# EAGLE schematic power supply diagram (EAGLE 9.6.2)
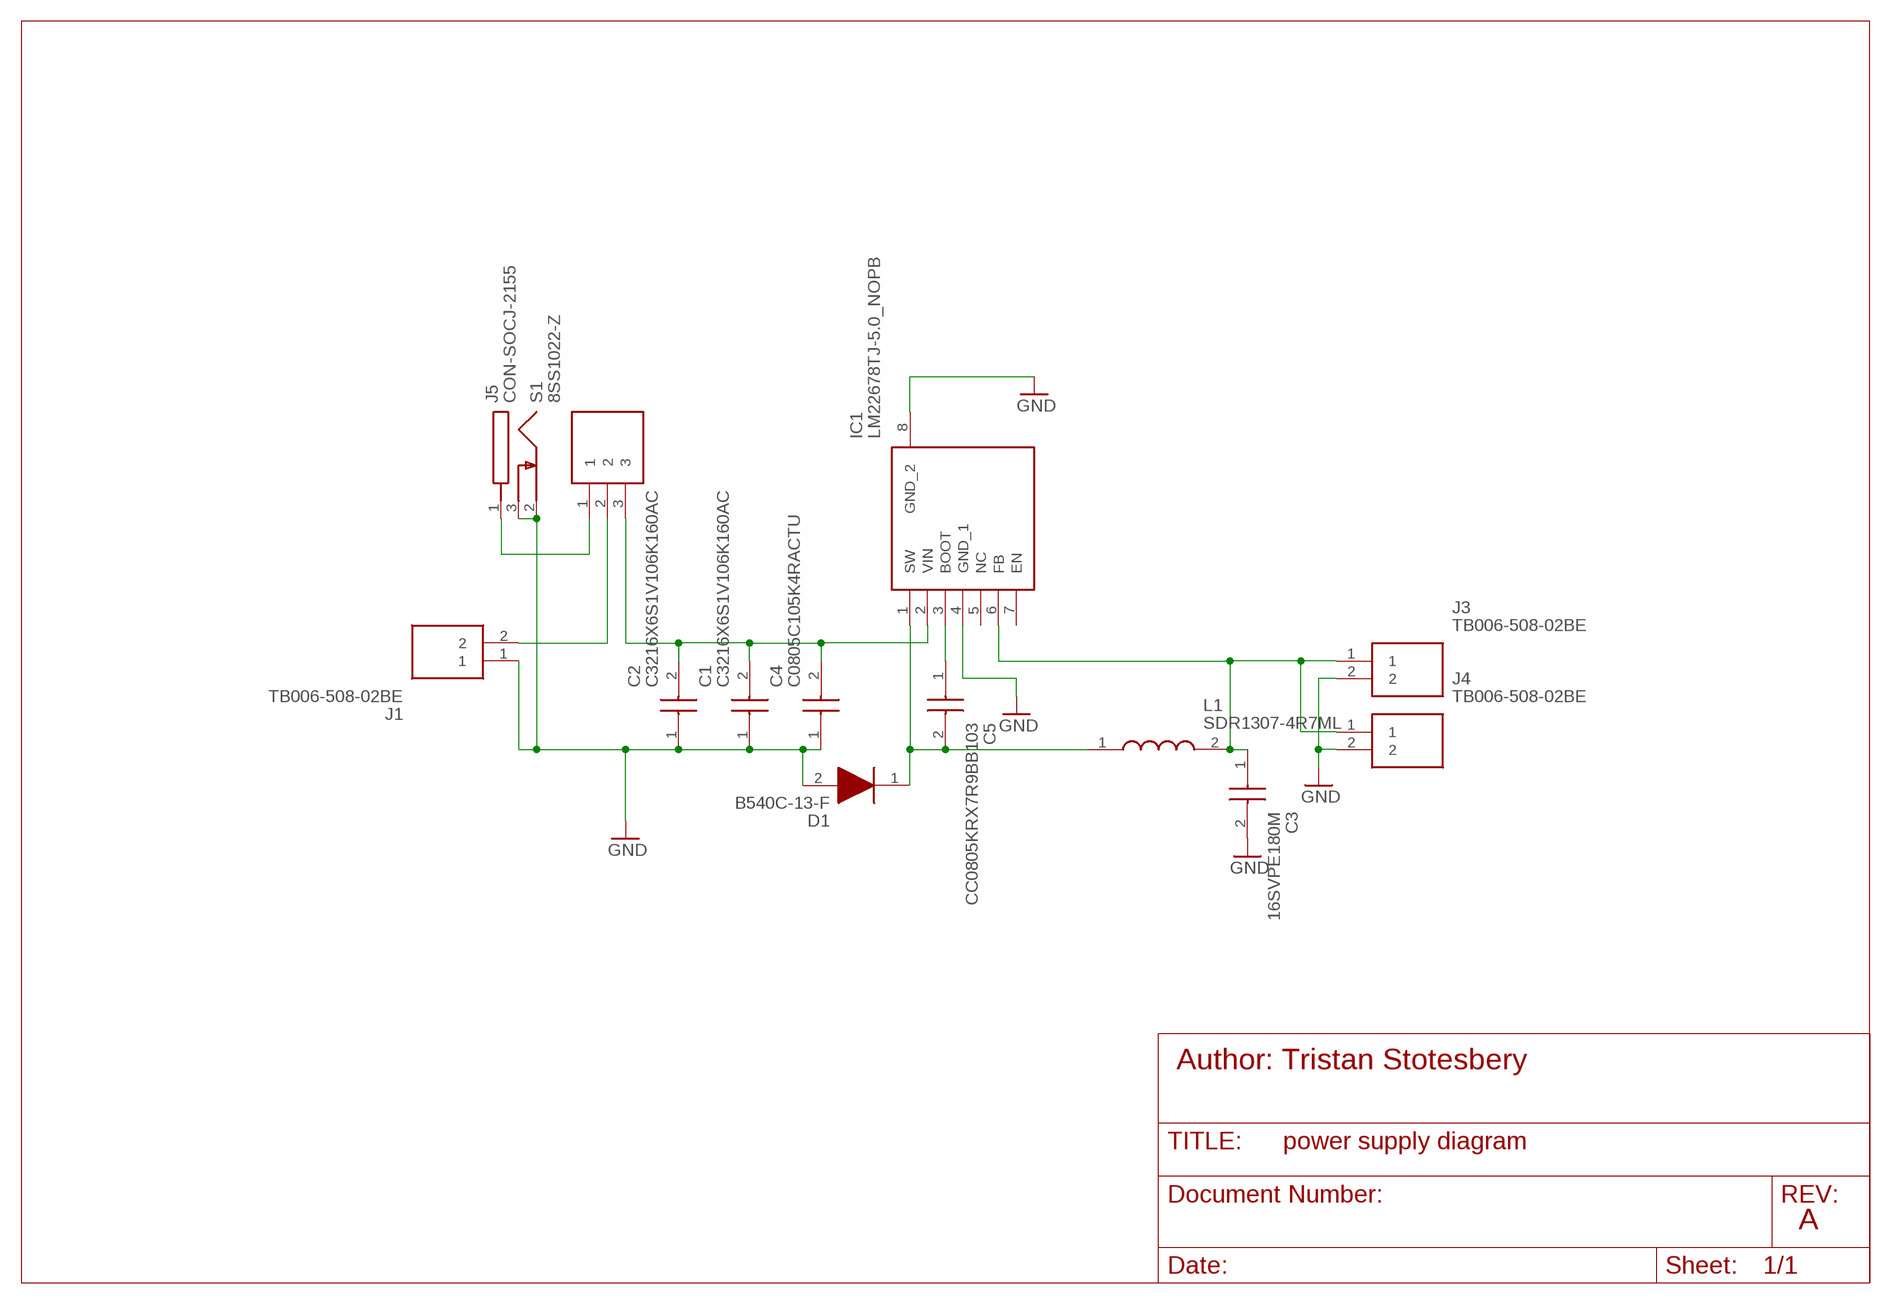
[diagram p0: schematic, sheet 1]

## Parts
C1  C3216X6S1V106K160AC  [CAPC3216X180N]
C2  C3216X6S1V106K160AC  [CAPC3216X180N]
C3  16SVPE180M  [16SVPE180M]
C4  C0805C105K4RACTU  [CAPC2012X100N]
C5  CC0805KRX7R9BB103  [CAPC2012X135N]
D1  B540C-13-F  [DIOM7959X250N]
IC1  LM22678TJ-5.0_NOPB  [LM22678TJ50NOPB]
J1  TB006-508-02BE  [TB00650802BE]
J3  TB006-508-02BE  [TB00650802BE]
J4  TB006-508-02BE  [TB00650802BE]
J5  CON-SOCJ-2155  [CONSOCJ2155]
L1  SDR1307-4R7ML  [SDR1307-220ML]
S1  8SS1022-Z  [8SS1022Z]

## Nets
GND: C1.1 C2.1 C3.2 C4.1 D1.2(A) IC1.4(GND_1) IC1.8(GND_2) J1.1 J3.2 J4.2 J5.2 J5.3
N$1: C1.2 C2.2 C4.2 IC1.2(VIN) S1.3
N$2: J1.2 S1.2
N$3: C5.1 IC1.3(BOOT)
N$4: C5.2 D1.1(K) IC1.1(SW) L1.1
N$5: C3.1 IC1.6(FB) J3.1 J4.1 L1.2
N$6: J5.1 S1.1
Unconnected: IC1.5(NC) IC1.7(EN)

## Notes on the sheet
- Author: Tristan Stotesbery
- A

## Library data of the parts
C1 C2 = SamacSys_Parts:C3216X6S1V106K160AC: Multilayer Ceramic Capacitors MLCC - SMD/SMT 1206 35V 10uF X6S 10% T: 1.6mm Source: Datasheet <https://product.tdk.com/info/en/catalog/datasheets/mlcc_commercial_midvoltage_en.pdf>; DESCRIPTION: Multilayer Ceramic Capacitors MLCC - SMD/SMT 1206 35V 10uF X6S 10% T: 1.6mm; HEIGHT: 1.8mm; MANUFACTURER_NAME: TDK; MANUFACTURER_PART_NUMBER: C3216X6S1V106K160AC; MOUSER_PART_NUMBER: 810-C3216X6S1V106K6A; MOUSER_PRICE-STOCK: https://www.mouser.co.uk/ProductDetail/TDK/C3216X6S1V106K160AC?qs=xLDY6iXSiQbqLIcRZVjJ3A%3D%3D
C3 = SamacSys_Parts:16SVPE180M: Panasonic Aluminium Polymer Capacitor 180uF 16V dc 6.3mm C10 OS-CON Series, Surface Mount Polymer, +/-20% 6.3 x 9.9mm Source: Datasheet <https://whttps://industrial.panasonic.com/cdbs/www-data/pdf/AAB8000/AAB8000C179.pdfww.arrow.com/en/products/16svpe180m/panasonic>; DESCRIPTION: Panasonic Aluminium Polymer Capacitor 180uF 16V dc 6.3mm C10 OS-CON Series, Surface Mount Polymer, +/-20% 6.3 x 9.9mm; HEIGHT: 10mm; MANUFACTURER_NAME: Panasonic; MANUFACTURER_PART_NUMBER: 16SVPE180M; MOUSER_PART_NUMBER: 667-16SVPE180M; MOUSER_PRICE-STOCK: https://www.mouser.co.uk/ProductDetail/Panasonic/16SVPE180M?qs=OE1iw1LrrPH8IiQtRMzKQA%3D%3D
C4 = SamacSys_Parts:C0805C105K4RACTU: 1uF Ceramic Multilayer Capacitor, 16V Source: Datasheet <http://www.kemet.com/Lists/ProductCatalog/Attachments/53/KEM_C1002_X7R_SMD.pdf>; DESCRIPTION: 1uF Ceramic Multilayer Capacitor, 16V; HEIGHT: 1mm; MANUFACTURER_NAME: Kemet; MANUFACTURER_PART_NUMBER: C0805C105K4RACTU; MOUSER_PART_NUMBER: 80-C0805C105K4R; MOUSER_PRICE-STOCK: https://www.mouser.co.uk/ProductDetail/KEMET/C0805C105K4RACTU?qs=yrVqjCObULOefkidH6lLLQ%3D%3D
C5 = SamacSys_Parts:CC0805KRX7R9BB103: 0805 X7R ceramic cap,10nF 50V Phycomp 10nF Multilayer Ceramic Capacitor (MLCC) 50 V dc +/-10% X7R dielectric Standard max op. temp. +125C Source: Datasheet; DESCRIPTION: 0805 X7R ceramic cap,10nF 50V Phycomp 10nF Multilayer Ceramic Capacitor (MLCC) 50 V dc +/-10% X7R dielectric Standard max op. temp. +125C; HEIGHT: 1.35mm; MANUFACTURER_NAME: YAGEO (PHYCOMP); MANUFACTURER_PART_NUMBER: CC0805KRX7R9BB103; MOUSER_PART_NUMBER: 603-CC805KRX7R9BB103; MOUSER_PRICE-STOCK: https://www.mouser.co.uk/ProductDetail/Yageo/CC0805KRX7R9BB103?qs=AgBp2OyFlx%252BOmOw2rEcWJw%3D%3D
D1 = SamacSys_Parts:B540C-13-F: Diodes Inc B540C-13-F, SMT Schottky Diode, 40V 5A, 2-Pin DO-214AB Source: Datasheet <https://componentsearchengine.com/Datasheets/2/B540C-13-F.pdf>; DESCRIPTION: Diodes Inc B540C-13-F, SMT Schottky Diode, 40V 5A, 2-Pin DO-214AB; HEIGHT: 2.5mm; MANUFACTURER_NAME: Diodes Inc.; MANUFACTURER_PART_NUMBER: B540C-13-F; MOUSER_PART_NUMBER: 621-B540C-F; MOUSER_PRICE-STOCK: https://www.mouser.co.uk/ProductDetail/Diodes-Incorporated/B540C-13-F?qs=v2dnQLbuoRZXHN%2FK4ft5%252Bg%3D%3D
IC1 = SamacSys_Parts:LM22678TJ-5.0_NOPB: SIMPLE SWITCHER 4.5V to 42V, 5A Step-Down Voltage Regulator with Precision Enable Source: Datasheet <http://www.ti.com/lit/gpn/LM22678>; DESCRIPTION: SIMPLE SWITCHER 4.5V to 42V, 5A Step-Down Voltage Regulator with Precision Enable; HEIGHT: 2.1mm; MANUFACTURER_NAME: Texas Instruments; MANUFACTURER_PART_NUMBER: LM22678TJ-5.0/NOPB; MOUSER_PART_NUMBER: 926-LM22678TJ50NOPB; MOUSER_PRICE-STOCK: https://www.mouser.co.uk/ProductDetail/Texas-Instruments/LM22678TJ-50-NOPB?qs=X1J7HmVL2ZHigSTWjAFUig%3D%3D
J1 J3 J4 = SamacSys_Parts:TB006-508-02BE: Fixed Terminal Blocks screw type, 5.08 , horizontal, 2 poles, CUI Blue, slotted screw, PCB mount Source: Datasheet; DESCRIPTION: Fixed Terminal Blocks screw type, 5.08 , horizontal, 2 poles, CUI Blue, slotted screw, PCB mount; HEIGHT: 10.4mm; MANUFACTURER_NAME: CUI Inc.; MANUFACTURER_PART_NUMBER: TB006-508-02BE; MOUSER_PART_NUMBER: 490-TB006-508-02BE; MOUSER_PRICE-STOCK: https://www.mouser.co.uk/ProductDetail/CUI-Devices/TB006-508-02BE?qs=vLWxofP3U2wEdOVV%2FaT04w%3D%3D
J5 = SamacSys_Parts:CON-SOCJ-2155: DC Power Connectors Power Jack/Connector 2.1mm x 5.5mm Source: Datasheet <http://www.produktinfo.conrad.com/datenblaetter/1500000-1599999/001582350-da-01-en-DC_EINBAUBUCHSE__SCHALTER_GESCHLOSSEN.pdf>; DESCRIPTION: DC Power Connectors Power Jack/Connector 2.1mm x 5.5mm; HEIGHT: 11mm; MANUFACTURER_NAME: Gravitech; MANUFACTURER_PART_NUMBER: CON-SOCJ-2155; MOUSER_PART_NUMBER: 992-CON-SOCJ-2155; MOUSER_PRICE-STOCK: https://www.mouser.co.uk/ProductDetail/Gravitech/CON-SOCJ-2155/?qs=fkzBJ5HM%252BdCcpvFQyQZHtA%3D%3D
L1 = SamacSys_Parts:SDR1307-4R7ML: Fixed Inductors 4.7uH 20% SMD 1307 Source: Datasheet <https://www.bourns.com/pdfs/SDR1307.pdf>; DESCRIPTION: Fixed Inductors 4.7uH 20% SMD 1307; HEIGHT: mm; MANUFACTURER_NAME: Bourns; MANUFACTURER_PART_NUMBER: SDR1307-4R7ML; MOUSER_PART_NUMBER: 652-SDR1307-4R7ML; MOUSER_PRICE-STOCK: https://www.mouser.co.uk/ProductDetail/Bourns/SDR1307-4R7ML?qs=uD%2FoUDWqfvTph9Rfuyszgg%3D%3D
S1 = 8SS1022-Z:8SS1022-Z: Slide Switches SPDT, ON-OFF-ON, slide, straight PC terminals, 6A @ 125V AC Source: Datasheet <https://componentsearchengine.com/Datasheets/2/8SS1022-Z.pdf>; DESCRIPTION: Slide Switches SPDT, ON-OFF-ON, slide, straight PC terminals, 6A @ 125V AC; HEIGHT: 14.85mm; MANUFACTURER_NAME: NIDEC COPAL; MANUFACTURER_PART_NUMBER: 8SS1022-Z; MOUSER_PART_NUMBER: 229-8SS1022-Z; MOUSER_PRICE-STOCK: https://www.mouser.co.uk/ProductDetail/Nidec-Copal/8SS1022-Z?qs=XeJtXLiO41S0FkmrxT6eNQ%3D%3D